# Altium project Clock_Lab.PrjPcb
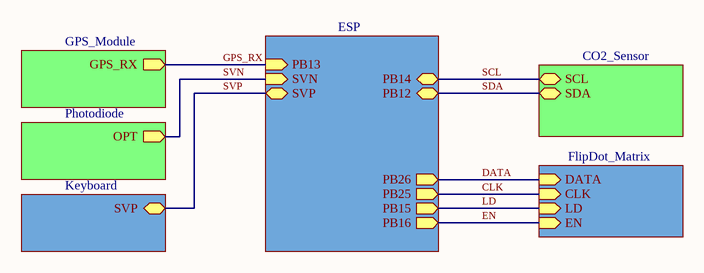
[diagram p0: Main.SchDoc]
7 sheets, 46 parts. Net scope: hierarchical (ports join the sheet entries above them; power ports are global).
Board file: Clock_Lab.PcbDoc
Sheets:
  Main.SchDoc
    ESP = ESP.SchDoc
    GPS_Module = GPS_Module.SchDoc
    CO2_Sensor = CO2_Sensor.SchDoc
    Keyboard = Keyboard.SchDoc
    Photodiode = Photodiode.SchDoc
    FlipDot_Matrix = FlipDot_Matrix.SchDoc

## Sheet Main.SchDoc: Lab. Proj. PCB
size A4; Author: Tomasz Machnik; Revision: 1; SheetNumber: 1; SheetTotal: 7

### Sub-sheets
CO2_Sensor = CO2_Sensor.SchDoc: SCL (bidir), SDA (bidir)
ESP = ESP.SchDoc: PB12 (bidir), PB14 (bidir), PB13 (in), SVN (in), SVP (bidir), PB25 (out), PB26 (out), PB15 (out), PB16 (out)
FlipDot_Matrix = FlipDot_Matrix.SchDoc: EN (in), LD (in), CLK (in), DATA (in)
GPS_Module = GPS_Module.SchDoc: GPS_RX (out)
Keyboard = Keyboard.SchDoc: SVP (bidir)
Photodiode = Photodiode.SchDoc: OPT (out)

### Nets
CLK: sheet ESP/PB25, sheet FlipDot_Matrix/CLK
DATA: sheet ESP/PB26, sheet FlipDot_Matrix/DATA
EN: sheet ESP/PB16, sheet FlipDot_Matrix/EN
GPS_RX: sheet ESP/PB13, sheet GPS_Module/GPS_RX
LD: sheet ESP/PB15, sheet FlipDot_Matrix/LD
SCL: sheet ESP/PB14, sheet CO2_Sensor/SCL
SDA: sheet ESP/PB12, sheet CO2_Sensor/SDA
SVN: sheet ESP/SVN, sheet Photodiode/OPT
SVP: sheet ESP/SVP, sheet Keyboard/SVP

### Notes on the sheet
- Title:
- Author:
- Approved:
- Size:
- Date:
- Git Hash:
- A4
- Prj:
- SW Version:
- Variant:
- Edited:
- CONFIDENTIAL
- File:

## Sheet ESP.SchDoc: Lab. Proj. PCB
size A4; Author: Tomasz Machnik; Revision: 1; SheetNumber: 4; SheetTotal: 7
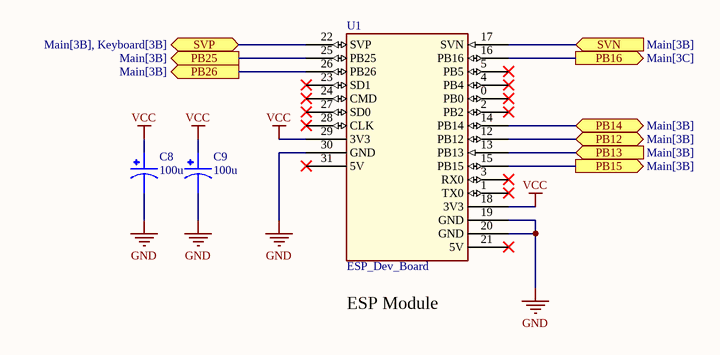
[diagram p1: ESP.SchDoc]

### Parts
C8  100u  [CAPPRD500W60D1330H2700]
C9  100u  [CAPPRD500W60D1330H2700]
U1  ESP_Dev_Board  [ESP_Dev_Board]

### Ports
PB12 (bidir, see Main[3B]), PB13 (in, see Main[3B]), PB14 (bidir, see Main[3B]), PB15 (out, see Main[3B]), PB16 (out, see Main[3C]), PB25 (out, see Main[3B]), PB26 (out, see Main[3B]), SVN (in, see Main[3B]), SVP (bidir, see Main[3B], Keyboard[3B])

### Nets
GND: C8.2 C9.2 U1.19(GND) U1.20(GND) U1.30(GND)
VCC: C8.1 C9.1 U1.18(3V3) U1.29(3V3)
CLK: U1.25(PB25) ; port PB25
DATA: U1.26(PB26) ; port PB26
EN: U1.16(PB16) ; port PB16
GPS_RX: U1.13(PB13) ; port PB13
LD: U1.15(PB15) ; port PB15
SCL: U1.14(PB14) ; port PB14
SDA: U1.12(PB12) ; port PB12
SVN: U1.17(SVN) ; port SVN
SVP: U1.22(SVP) ; port SVP

Not connected (* = marked no-connect by the designer): U1 0(PB0)* 1(TX0)* 2(PB2)* 3(RX0)* 4(PB4)* 5(PB5)* 21(5V)* 23(SD1)* 24(CMD)* 27(SD0)* 28(CLK)* 31(5V)*

### Notes on the sheet
- (near U1) ESP Module
- Title:
- Author:
- Approved:
- Size:
- Date:
- Git Hash:
- A4
- Prj:
- SW Version:
- Variant:
- Edited:
- CONFIDENTIAL
- File:

### Library data of the parts
C8 C9 = 478CKS010M: 4700 ÂµF 10 V Aluminum Electrolytic Capacitors Radial, Can 98.8mOhm @ 120Hz 2000 Hrs @ 85Â°C; MF: Illinois Capacitor; SnapEDA_Link: https://www.snapeda.com/parts/478CKS010M/Illinois+Capacitor/view-part/?ref=snap; Package: Radial Illinois Capacitor; Value: *; MP: 478CKS010M; Check_prices: https://www.snapeda.com/parts/478CKS010M/Illinois+Capacitor/view-part/?ref=eda
U1 = ESP_Dev_Board: ESP Dev Board with lcd

## Sheet GPS_Module.SchDoc: Lab. Proj. PCB
size A4; Author: Tomasz Machnik; Revision: 1; SheetNumber: 7; SheetTotal: 7
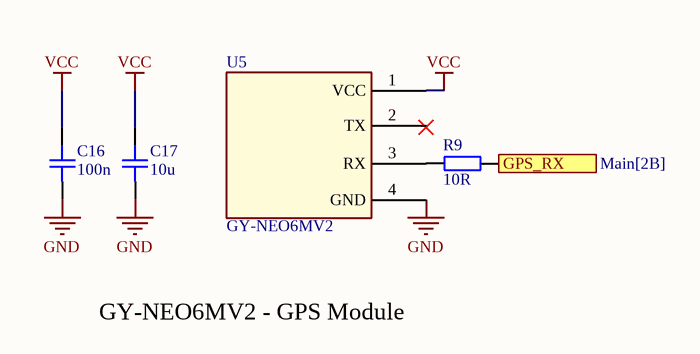
[diagram p2: GPS_Module.SchDoc]

### Parts
C16  100n  [CAP_0805]
C17  10u  [CAP_0805]
R9  10R  [RES_0805]
U5  GY-NEO6MV2  [GY-NEO6MV]

### Ports
GPS_RX (out, see Main[2B])

### Nets
GND: C16.1 C17.1 U5.4(GND)
VCC: C16.2 C17.2 U5.1(VCC)
GPS_RX: R9.2 ; port GPS_RX
NetR9_1: R9.1 U5.3(RX)

Not connected (* = marked no-connect by the designer): U5 2(TX)

### Notes on the sheet
- GY-NEO6MV2 - GPS Module
- Title:
- Author:
- Approved:
- Size:
- Date:
- Git Hash:
- A4
- Prj:
- SW Version:
- Variant:
- Edited:
- CONFIDENTIAL
- File:

### Library data of the parts
C16 C17 = CAP_0805: Capacitor SMD 0805; Manufacturer: *; Manufacturer Part Number: *; Distributor Link: *; LCSC: *; Rating: *; Dielectric: *
R9 = RES_0805: Resistor SMD 0805; Manufacturer: *; Manufacturer Part Number: *; Distributor Link: *; LCSC: *

## Sheet CO2_Sensor.SchDoc: Lab. Proj. PCB
size A4; Author: Tomasz Machnik; Revision: 1; SheetNumber: 2; SheetTotal: 7
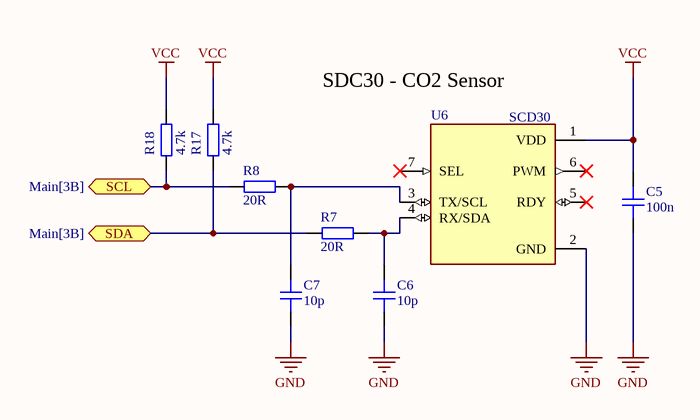
[diagram p3: CO2_Sensor.SchDoc]

### Parts
C5  100n  [CAP_0805]
C6  10p  [CAP_0805]
C7  10p  [CAP_0805]
R7  20R  [RES_0805]
R8  20R  [RES_0805]
R17  4.7k  [RES_0805]
R18  4.7k  [RES_0805]
U6  SCD30  [SDC30]

### Ports
SCL (bidir, see Main[3B]), SDA (bidir, see Main[3B])

### Nets
GND: C5.1 C6.1 C7.1 U6.2(GND)
VCC: C5.2 R17.1 R18.1 U6.1(VDD)
SCL: R8.2 R18.2 ; port SCL
SDA: R7.2 R17.2 ; port SDA
NetC6_2: C6.2 R7.1 U6.4(RX/SDA)
NetC7_2: C7.2 R8.1 U6.3(TX/SCL)

Not connected (* = marked no-connect by the designer): U6 5(RDY)* 6(PWM)* 7(SEL)*

### Notes on the sheet
- (near U6) SDC30 - CO2 Sensor
- Title:
- Author:
- Approved:
- Size:
- Date:
- Git Hash:
- A4
- Prj:
- SW Version:
- Variant:
- Edited:
- CONFIDENTIAL
- File:

### Library data of the parts
C5-C7 = CAP_0805: Capacitor SMD 0805; Manufacturer: *; Manufacturer Part Number: *; Distributor Link: *; LCSC: *; Rating: *; Dielectric: *
R7 R8 R17 R18 = RES_0805: Resistor SMD 0805; Manufacturer: *; Manufacturer Part Number: *; Distributor Link: *; LCSC: *
U6 = SCD30: SCD30 Series 5.5 V 75 mA Â±3% Carbon Dioxide (CO2) Sensor Module; Package: None; Availability: Unavailable; MP: SCD30; Value: *; Price: None

## Sheet Keyboard.SchDoc: Lab. Proj. PCB
size A4; Author: Tomasz Machnik; Revision: 1; SheetNumber: 3; SheetTotal: 7
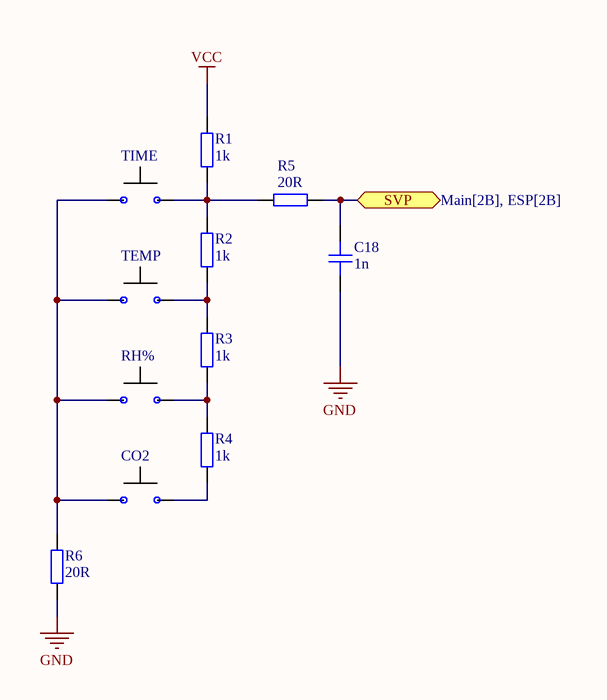
[diagram p4: Keyboard.SchDoc]

### Parts
C18  1n  [CAP_0805]
CO2  Tact_Switch  [Tact_Switch]  (value not drawn)
R1  1k  [RES_0805]
R2  1k  [RES_0805]
R3  1k  [RES_0805]
R4  1k  [RES_0805]
R5  20R  [RES_0805]
R6  20R  [RES_0805]
RH%  Tact_Switch  [Tact_Switch]  (value not drawn)
TEMP  Tact_Switch  [Tact_Switch]  (value not drawn)
TIME  Tact_Switch  [Tact_Switch]  (value not drawn)

### Ports
SVP (bidir, see Main[2B], ESP[2B])

### Nets
GND: C18.1 R6.1
VCC: R1.2
SVP: C18.2 R5.1 ; port SVP
NetCO2_1: CO2.1(PIN) R6.2 RH%.1(PIN) TEMP.1(PIN) TIME.1(PIN)
NetCO2_2: CO2.2(PIN) R4.1
NetR1_1: R1.1 R2.2 R5.2 TIME.2(PIN)
NetR2_1: R2.1 R3.2 TEMP.2(PIN)
NetR3_1: R3.1 R4.2 RH%.2(PIN)

### Notes on the sheet
- Title:
- Author:
- Approved:
- Size:
- Date:
- Git Hash:
- A4
- Prj:
- SW Version:
- Variant:
- Edited:
- CONFIDENTIAL
- File:

### Library data of the parts
C18 = CAP_0805: Capacitor SMD 0805; Manufacturer: *; Manufacturer Part Number: *; Distributor Link: *; LCSC: *; Rating: *; Dielectric: *
R1-R6 = RES_0805: Resistor SMD 0805; Manufacturer: *; Manufacturer Part Number: *; Distributor Link: *; LCSC: *

## Sheet Photodiode.SchDoc: Lab. Proj. PCB
size A4; Author: Tomasz Machnik; Revision: 1; SheetNumber: 5; SheetTotal: 7
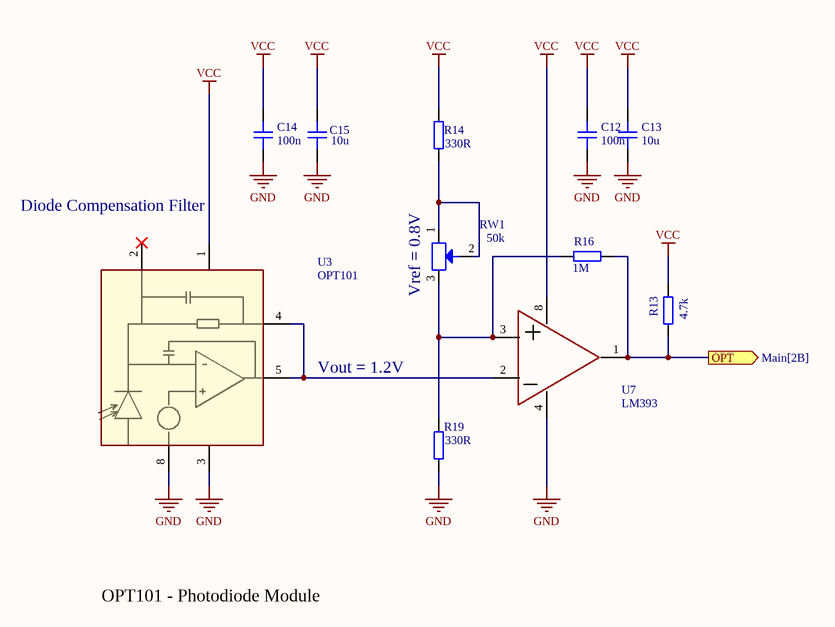
[diagram p5: Photodiode.SchDoc]

### Parts
C12  100n  [CAP_0805]
C13  10u  [CAP_0805]
C14  100n  [CAP_0805]
C15  10u  [CAP_0805]
R13  4.7k  [RES_0805]
R14  330R  [RES_0805]
R16  1M  [RES_0805]
R19  330R  [RES_0805]
RW1  50k  [Potentiometer]
U3  OPT101  [OPT101]
U7  LM393  [LM393]

### Ports
OPT (out, see Main[2B])

### Nets
GND: C12.1 C13.1 C14.1 C15.1 R19.1 U3.3 U3.8 U7.4(VSS)
VCC: C12.2 C13.2 C14.2 C15.2 R13.2 R14.2 U3.1 U7.8
SVN: R13.1 R16.1 U7.1(OUT) ; port OPT
NetR14_1: R14.1 RW1.1 RW1.2
NetR16_2: R16.2 R19.2 RW1.3 U7.3
NetU3_4: U3.4 U3.5 U7.2

Not connected (* = marked no-connect by the designer): U3 2(17)*

### Notes on the sheet
- Diode Compensation Filter
- (near RW1) Vref = 0.8V
- Vout = 1.2V
- OPT101 - Photodiode Module
- Title:
- Author:
- Approved:
- Size:
- Date:
- Git Hash:
- A4
- Prj:
- SW Version:
- Variant:
- Edited:
- CONFIDENTIAL
- File:

### Library data of the parts
C12-C15 = CAP_0805: Capacitor SMD 0805; Manufacturer: *; Manufacturer Part Number: *; Distributor Link: *; LCSC: *; Rating: *; Dielectric: *
R13 R14 R16 R19 = RES_0805: Resistor SMD 0805; Manufacturer: *; Manufacturer Part Number: *; Distributor Link: *; LCSC: *
RW1 = Potentiometer: Parameter 1: *
U3 = OPT101: Photodiode Module
U7 = LM393: LLM393 - Comparator

## Sheet FlipDot_Matrix.SchDoc: Lab. Proj. PCB
size A4; Author: Tomasz Machnik; Revision: 1; SheetNumber: 6; SheetTotal: 7
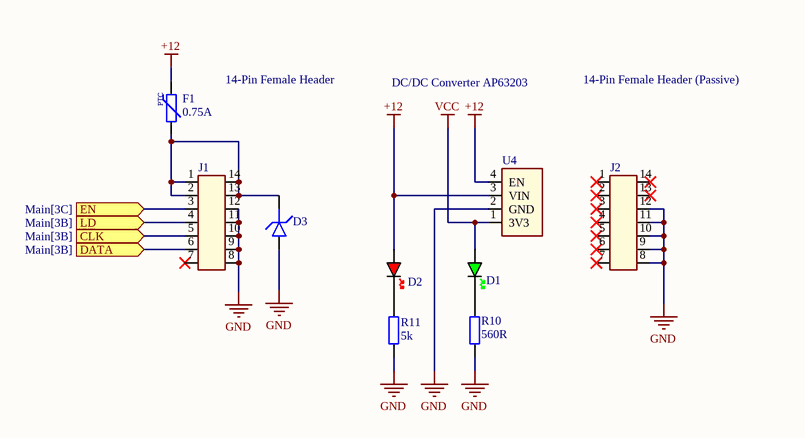
[diagram p6: FlipDot_Matrix.SchDoc]

### Parts
D1  GREEN  [LED_0603_GREEN]  (value not drawn)
D2  RED  [LED_0603_RED]  (value not drawn)
D3  D_TVS_0402  [D_0402]  (value not drawn)
F1  0.75A  [FUSE_1206]
J1  14-Pin Female Header  [SAMTEC_14_PIN]
J2  14-Pin Female Header (Passive)  [SAMTEC_14_PIN]
R10  560R  [RES_0805]
R11  5k  [RES_0805]
U4  DC/DC Converter AP63203  [DC/DC_CONVERTER]

### Ports
CLK (in, see Main[3B]), DATA (in, see Main[3B]), EN (in, see Main[3C]), LD (in, see Main[3B])

### Nets
+12: D2.A F1.2 U4.3(VIN) U4.4(EN)
GND: D3.A J1.8 J1.9 J1.10 J1.11 J1.12 J2.8 J2.9 J2.10 J2.11 J2.12 R10.1 R11.1 U4.2(GND)
VCC: D1.A U4.1(3V3)
CLK: J1.5 ; port CLK
DATA: J1.6 ; port DATA
EN: J1.3 ; port EN
LD: J1.4 ; port LD
NetD1_K: D1.K R10.2
NetD2_K: D2.K R11.2
NetD3_K: D3.K F1.1 J1.1 J1.2 J1.13 J1.14

Not connected (* = marked no-connect by the designer): J1 7*; J2 1* 2* 3* 4* 5* 6* 7* 13* 14*

### Notes on the sheet
- Title:
- Author:
- Approved:
- Size:
- Date:
- Git Hash:
- A4
- Prj:
- SW Version:
- Variant:
- Edited:
- CONFIDENTIAL
- File:
- (in symbol FUSE_PPTC_1206) PTC

### Library data of the parts
D1 = LED_0603_GREEN: LED 0603 GREEN SMD
D2 = LED_0603_RED: LED 0603 RED SMD
D3 = D_TVS_0402: Diode TVS / ESD 0402
F1 = FUSE_PPTC_1206: Fuse PPTC SMD 1206; Manufacturer: *; Manufacturer Part Number: *
J1 J2 = 14-Pin-Connector
R10 R11 = RES_0805: Resistor SMD 0805; Manufacturer: *; Manufacturer Part Number: *; Distributor Link: *; LCSC: *

## Nets that join several sheets
GND: ESP (5 pins), GPS_Module (C16.1 C17.1 U5.4), CO2_Sensor (C5.1 C6.1 C7.1 U6.2), Keyboard (C18.1 R6.1), Photodiode (8 pins), FlipDot_Matrix (14 pins)
VCC: ESP (C8.1 C9.1 U1.18 U1.29), GPS_Module (C16.2 C17.2 U5.1), CO2_Sensor (C5.2 R17.1 R18.1 U6.1), Keyboard (R1.2), Photodiode (8 pins), FlipDot_Matrix (D1.A U4.1)
CLK: ESP (U1.25), FlipDot_Matrix (J1.5)
DATA: ESP (U1.26), FlipDot_Matrix (J1.6)
EN: ESP (U1.16), FlipDot_Matrix (J1.3)
GPS_RX: ESP (U1.13), GPS_Module (R9.2)
LD: ESP (U1.15), FlipDot_Matrix (J1.4)
SCL: ESP (U1.14), CO2_Sensor (R8.2 R18.2)
SDA: ESP (U1.12), CO2_Sensor (R7.2 R17.2)
SVN: ESP (U1.17), Photodiode (R13.1 R16.1 U7.1)
SVP: ESP (U1.22), Keyboard (C18.2 R5.1)